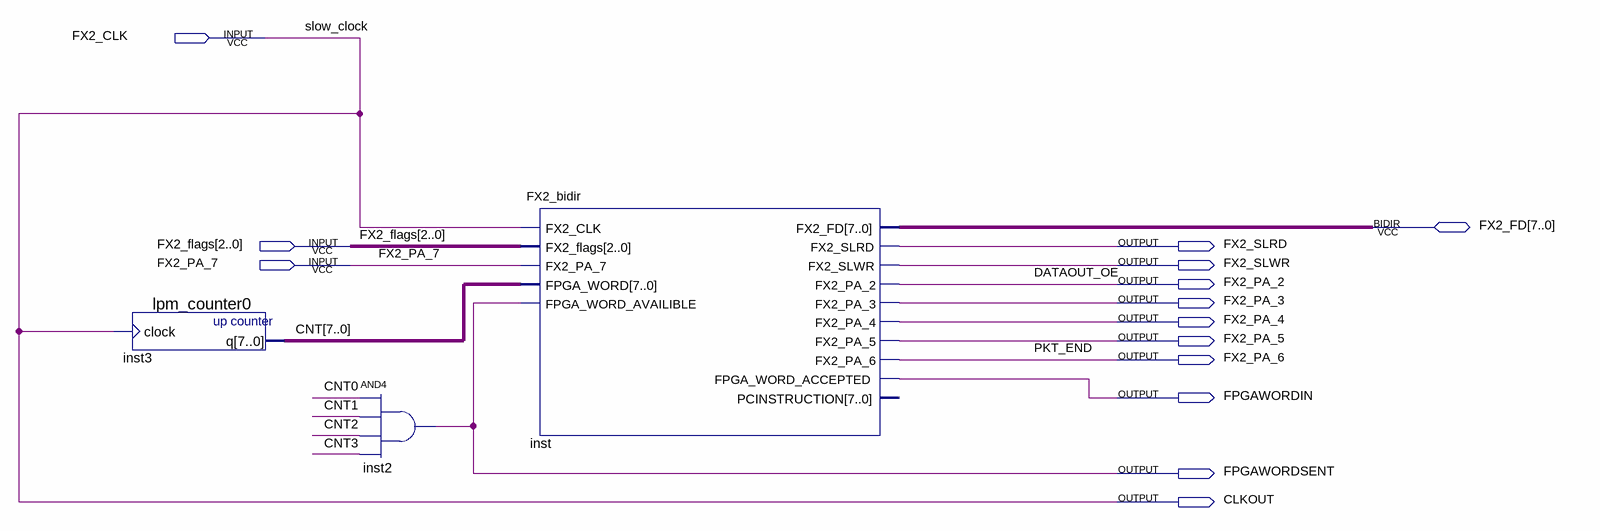
[diagram p0: schematic sheet]
// Quartus schematic testingigo-xxx.bdf as structural Verilog: 3 symbols, 14 pins
module \testingigo-xxx  (
  input  FX2_CLK,
  input  [2:0] FX2_flags,
  input  FX2_PA_7,
  inout  [7:0] FX2_FD,
  output FX2_SLRD,
  output FX2_SLWR,
  output FX2_PA_2,
  output FX2_PA_3,
  output FX2_PA_4,
  output FX2_PA_5,
  output FX2_PA_6,
  output FPGAWORDIN,
  output FPGAWORDSENT,
  output CLKOUT
);

  wire [7:0] CNT;

  lpm_counter0 inst3 (.clock(FX2_CLK), .q(CNT));
  and inst2 (FPGAWORDSENT, CNT[0], CNT[1], CNT[2], CNT[3]);
  FX2_bidir inst (
    .FX2_CLK(FX2_CLK), .FX2_flags(FX2_flags), .FX2_PA_7(FX2_PA_7), .FPGA_WORD(CNT),
    .FPGA_WORD_AVAILIBLE(FPGAWORDSENT), .FX2_SLRD(FX2_SLRD), .FX2_SLWR(FX2_SLWR), .FX2_PA_2(FX2_PA_2),
    .FX2_PA_3(FX2_PA_3), .FX2_PA_4(FX2_PA_4), .FX2_PA_5(FX2_PA_5), .FX2_PA_6(FX2_PA_6),
    .FPGA_WORD_ACCEPTED(FPGAWORDIN), .FX2_FD(FX2_FD));  // open: PCINSTRUCTION

  assign CLKOUT = FX2_CLK;

  // Other names for the same wires on the sheet: DATAOUT_OE = FX2_PA_2; PKT_END = FX2_PA_6; slow_clock = FX2_CLK
endmodule
